# Altium schematic sheet CV060_AI.SchDoc
size A4
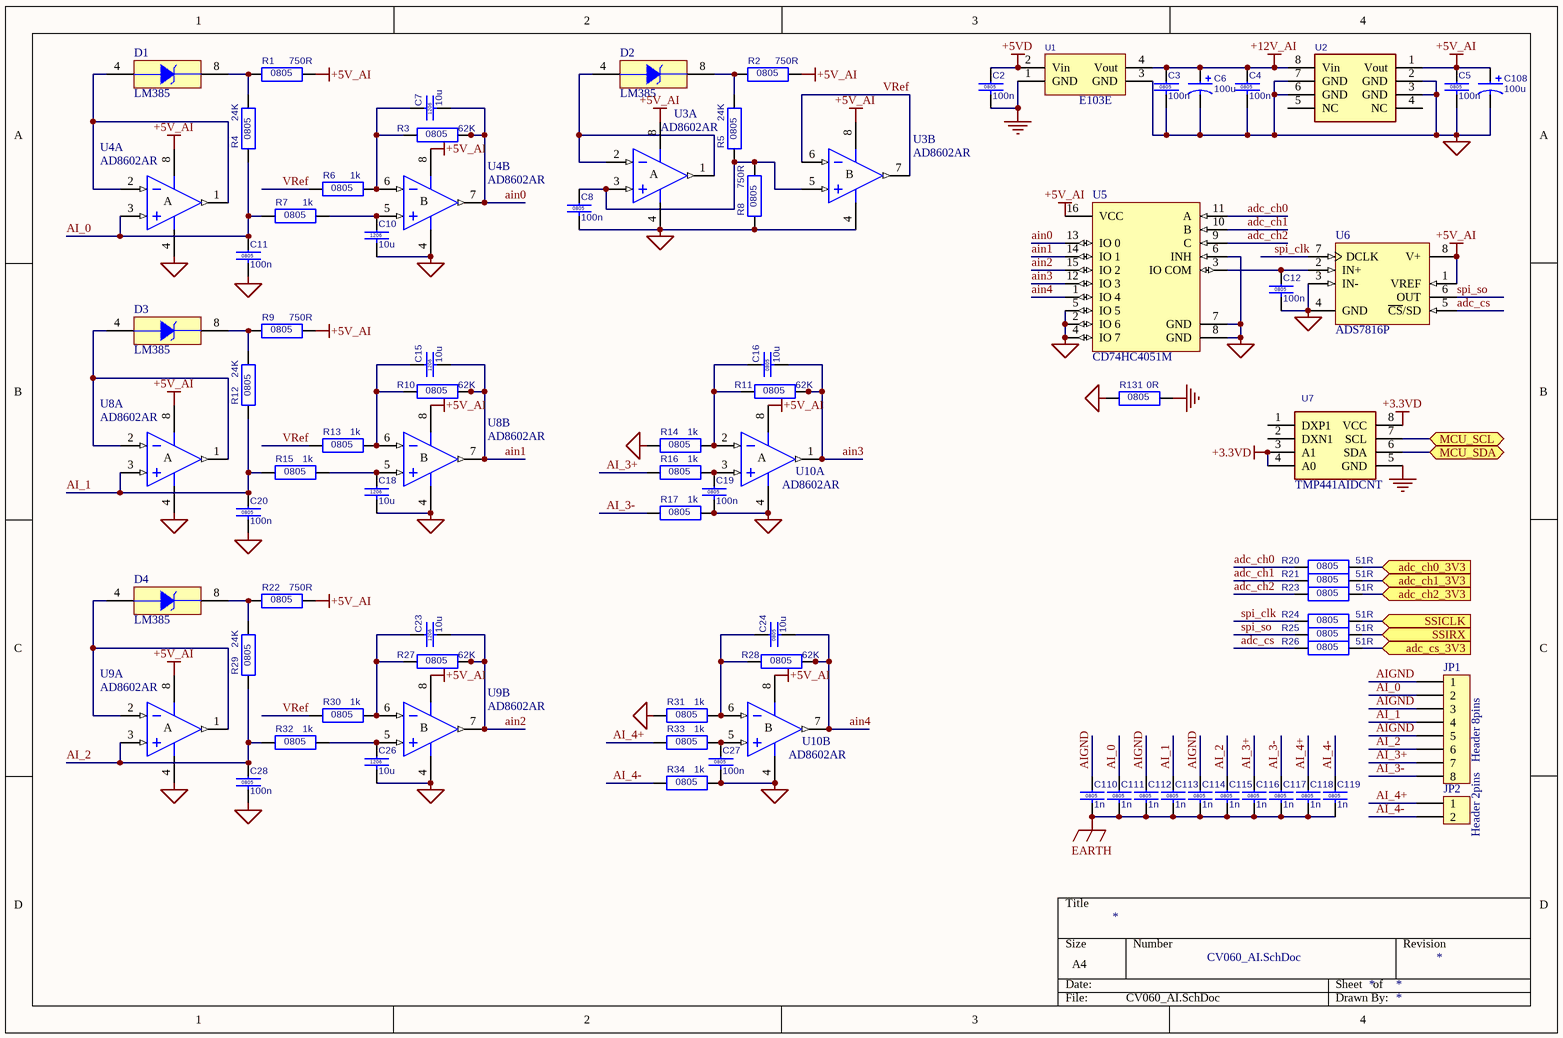
[diagram p0: CV060_AI.SchDoc]

## Parts
C2  Case: 0805  [RC0805]  (hidden comment: 100n)
C3  Case: 0805  [RC0805]  (hidden comment: 100n)
C4  Case: 0805  [RC0805]  (hidden comment: 100n)
C5  Case: 0805  [RC0805]  (hidden comment: 100n)
C6  100u  [CEH12.5D5P2.5]
C7  Case: 1206  [RC1206]  (hidden comment: 10u)
C8  Case: 0805  [RC0805]  (hidden comment: 100n)
C10  Case: 1206  [RC1206]  (hidden comment: 10u)
C11  Case: 0805  [RC0805]  (hidden comment: 100n)
C12  Case: 0805  [RC0805]  (hidden comment: 100n)
C15  Case: 1206  [RC1206]  (hidden comment: 10u)
C16  Case: 0805  [RC0805]  (hidden comment: 10u)
C18  Case: 1206  [RC1206]  (hidden comment: 10u)
C19  Case: 0805  [RC0805]  (hidden comment: 100n)
C20  Case: 0805  [RC0805]  (hidden comment: 100n)
C23  Case: 1206  [RC1206]  (hidden comment: 10u)
C24  Case: 0805  [RC0805]  (hidden comment: 10u)
C26  Case: 1206  [RC1206]  (hidden comment: 10u)
C27  Case: 0805  [RC0805]  (hidden comment: 100n)
C28  Case: 0805  [RC0805]  (hidden comment: 100n)
C108  100u  [CEH12.5D5P2.5]
C110  Case: 0805  [RC0805]  (hidden comment: 1n)
C111  Case: 0805  [RC0805]  (hidden comment: 1n)
C112  Case: 0805  [RC0805]  (hidden comment: 1n)
C113  Case: 0805  [RC0805]  (hidden comment: 1n)
C114  Case: 0805  [RC0805]  (hidden comment: 1n)
C115  Case: 0805  [RC0805]  (hidden comment: 1n)
C116  Case: 0805  [RC0805]  (hidden comment: 1n)
C117  Case: 0805  [RC0805]  (hidden comment: 1n)
C118  Case: 0805  [RC0805]  (hidden comment: 1n)
C119  Case: 0805  [RC0805]  (hidden comment: 1n)
D1  LM385  [SO-8]
D2  LM385  [SO-8]
D3  LM385  [SO-8]
D4  LM385  [SO-8]
JP1  Header 8pins  [PHOENIX_5.08_8PINS]
JP2  Header 2pins  [PHOENIX_5.08_2PINS]
R1  Case: 0805  [RC0805]  (hidden comment: 750R)
R2  Case: 0805  [RC0805]  (hidden comment: 750R)
R3  Case: 0805  [RC0805]  (hidden comment: 62K)
R4  Case: 0805  [RC0805]  (hidden comment: 24K)
R5  Case: 0805  [RC0805]  (hidden comment: 24K)
R6  Case: 0805  [RC0805]  (hidden comment: 1k)
R7  Case: 0805  [RC0805]  (hidden comment: 1k)
R8  Case: 0805  [RC0805]  (hidden comment: 750R)
R9  Case: 0805  [RC0805]  (hidden comment: 750R)
R10  Case: 0805  [RC0805]  (hidden comment: 62K)
R11  Case: 0805  [RC0805]  (hidden comment: 62K)
R12  Case: 0805  [RC0805]  (hidden comment: 24K)
R13  Case: 0805  [RC0805]  (hidden comment: 1k)
R14  Case: 0805  [RC0805]  (hidden comment: 1k)
R15  Case: 0805  [RC0805]  (hidden comment: 1k)
R16  Case: 0805  [RC0805]  (hidden comment: 1k)
R17  Case: 0805  [RC0805]  (hidden comment: 1k)
R20  Case: 0805  [RC0805]  (hidden comment: 51R)
R21  Case: 0805  [RC0805]  (hidden comment: 51R)
R22  Case: 0805  [RC0805]  (hidden comment: 750R)
R23  Case: 0805  [RC0805]  (hidden comment: 51R)
R24  Case: 0805  [RC0805]  (hidden comment: 51R)
R25  Case: 0805  [RC0805]  (hidden comment: 51R)
R26  Case: 0805  [RC0805]  (hidden comment: 51R)
R27  Case: 0805  [RC0805]  (hidden comment: 62K)
R28  Case: 0805  [RC0805]  (hidden comment: 62K)
R29  Case: 0805  [RC0805]  (hidden comment: 24K)
R30  Case: 0805  [RC0805]  (hidden comment: 1k)
R31  Case: 0805  [RC0805]  (hidden comment: 1k)
R32  Case: 0805  [RC0805]  (hidden comment: 1k)
R33  Case: 0805  [RC0805]  (hidden comment: 1k)
R34  Case: 0805  [RC0805]  (hidden comment: 1k)
R131  Case: 0805  [RC0805]  (hidden comment: 0R)
U1  Manufacturer Part Number: E103E  [SIP4]
U2  L78L05CD  [SO-8]  (value not drawn)
U3  AD8602AR  [SO-8]  (parts A,B of 2)
U4  AD8602AR  [SO-8]  (parts A,B of 2)
U5  CD74HC4051M  [SO-16]
U6  ADS7816P  [DIP-8]
U7  TMP441AIDCNT  [SOT23-8]
U8  AD8602AR  [SO-8]  (parts A,B of 2)
U9  AD8602AR  [SO-8]  (parts A,B of 2)
U10  AD8602AR  [SO-8]  (parts A,B of 2)

## Ports
adc_ch0_3V3 (in), adc_ch1_3V3 (in), adc_ch2_3V3 (in), adc_cs_3V3 (in), MCU_SCL, MCU_SDA, SSICLK (in), SSIRX (in)

## Nets
+3.3VD: U7.3(A1) U7.4(A0) U7.8(VCC)
+5V_AI: C5.1 C108.1 R1.2 R2.2 R9.2 R22.2 U2.1(Vout) U3.8(V+) U4.8(V+) U5.16(VCC) U6.1(VREF) U6.8(V+) U8.8(V+) U9.8(V+) U10.8(V+)
+5VD: C2.1 U1.2(Vin)
+12V_AI: C3.1 C4.1 C6.1 U1.4(Vout) U2.8(Vin)
AIGND: C3.2 C4.2 C5.2 C6.2 C8.2 C10.2 C11.2 C12.2 C18.2 C19.2 C20.2 C26.2 C27.2 C28.2 C108.2 C110.1 C112.1 C114.1 JP1.1 JP1.3 JP1.5 R8.1 R14.1 R17.2 R31.1 R34.2 R131.1 U1.3(GND) U2.2(GND) U2.3(GND) U2.6(GND) U2.7(GND) U3.4(V-) U4.4(V-) U5.2(IO_6) U5.4(IO_7) U5.5(IO_5) U5.6(INH) U5.7(GND) U5.8(GND) U6.3(IN-) U6.4(GND) U8.4(V-) U9.4(V-) U10.4(V-)
DGND: C2.2 R131.2 U1.1(GND) U7.5(GND)
EARTH: C110.2 C111.2 C112.2 C113.2 C114.2 C115.2 C116.2 C117.2 C118.2 C119.2
adc_ch0: R20.1 U5.11(A)
adc_ch0_3V3: R20.2 ; port adc_ch0_3V3
adc_ch1: R21.1 U5.10(B)
adc_ch1_3V3: R21.2 ; port adc_ch1_3V3
adc_ch2: R23.1 U5.9(C)
adc_ch2_3V3: R23.2 ; port adc_ch2_3V3
adc_cs: R26.1 U6.5(~{CS}/SD)
adc_cs_3V3: R26.2 ; port adc_cs_3V3
AI_0: C11.1 C111.1 JP1.2 R4.1 R7.1 U4.3(IN+)
AI_1: C20.1 C113.1 JP1.4 R12.1 R15.1 U8.3(IN+)
AI_2: C28.1 C115.1 JP1.6 R29.1 R32.1 U9.3(IN+)
AI_3+: C116.1 JP1.7 R16.1
AI_3-: C117.1 JP1.8 R17.1
AI_4+: C118.1 JP2.1 R33.1
AI_4-: C119.1 JP2.2 R34.1
ain0: C7.2 R3.2 U4.7(OUT) U5.13(IO_0)
ain1: C15.2 R10.2 U5.14(IO_1) U8.7(OUT)
ain2: C23.2 R27.2 U5.15(IO_2) U9.7(OUT)
ain3: C16.2 R11.2 U5.12(IO_3) U10.1(OUT)
ain4: C24.2 R28.2 U5.1(IO_4) U10.7(OUT)
MCU_SCL: U7.7(SCL) ; port MCU_SCL
MCU_SDA: U7.6(SDA) ; port MCU_SDA
spi_clk: R24.1 U6.7(DCLK)
spi_so: R25.1 U6.6(OUT)
SSICLK: R24.2 ; port SSICLK
SSIRX: R25.2 ; port SSIRX
VRef: R6.1 R13.1 R30.1 U3.6(IN-) U3.7(OUT)
NetC7_1: C7.1 R3.1 R6.2 U4.6(IN-)
NetC8_1: C8.1 R5.1 R8.2 U3.3(IN+) U3.5(IN+)
NetC10_1: C10.1 R7.2 U4.5(IN+)
NetC12_1: C12.1 U5.3(IO_COM) U6.2(IN+)
NetC15_1: C15.1 R10.1 R13.2 U8.6(IN-)
NetC16_1: C16.1 R11.1 R14.2 U10.2(IN-)
NetC18_1: C18.1 R15.2 U8.5(IN+)
NetC19_1: C19.1 R16.2 U10.3(IN+)
NetC23_1: C23.1 R27.1 R30.2 U9.6(IN-)
NetC24_1: C24.1 R28.1 R31.2 U10.6(IN-)
NetC26_1: C26.1 R32.2 U9.5(IN+)
NetC27_1: C27.1 R33.2 U10.5(IN+)
NetD1_4: D1.4(A) U4.1(OUT) U4.2(IN-)
NetD1_8: D1.8(K) R1.1 R4.2
NetD2_4: D2.4(A) U3.1(OUT) U3.2(IN-)
NetD2_8: D2.8(K) R2.1 R5.2
NetD3_4: D3.4(A) U8.1(OUT) U8.2(IN-)
NetD3_8: D3.8(K) R9.1 R12.2
NetD4_4: D4.4(A) U9.1(OUT) U9.2(IN-)
NetD4_8: D4.8(K) R22.1 R29.2

Not connected (* = marked no-connect by the designer): U2 4(NC) 5(NC); U7 1(DXP1) 2(DXN1)

## Notes on the sheet
- (in symbol AD8602AR, part A) A
- (in symbol AD8602AR, part B) B

## Library data of the parts
C2-C5 C8 C11 C12 C19 C20 C27 C28 = CC0805K-X5R-50V0-100N: Chip capacitor, 20p; Manufacturer: KEMET, YAGEO; Voltage: 50V; Tolerance: 10%; ROSH: Yes; Material: X5R; Package: 7" paper reel; Part number: CC0805K-X5R-50V0-100N; Suppliers: Avnet; Temperature: -55 - +125 C; Value: 100n; Supplier: Avnet-Abacus; Pb Free: Yes; Component Type: Standard; ComponentLink1Description: Manufacturer Link; ComponentLink2Description: Datasheet; ComponentLink2URL: http://www.yageo.com/pdf/UPY-GPHC_X5R_6.3V-to-50V_3.pdf; Published: 05.04.2010; Publisher: ppavlov
C6 C108 = CEH12.5D5P2.5M-16V-100U: Electrolytic capacitor; Manufacturer: Panasonic; Manufacturer Part Number: C H12.5D5P2.5M-16V-100U; Voltage: 16V; Tolerance: 20%; Pb Free: Yes; Case: 12.5x5x2.5; Value: 100u; Part Number: CEH12.5D5P2.5M-16V-100U; Temperature: -55 - +105 C; Supplier: Megasan; MOQ: 500; Component Type: Standard; ComponentLink1Description: Manufacturer Link; ComponentLink2Description: Datasheet; ComponentLink2URL: http://industrial.panasonic.com/www-data/pdf/ABA0000/ABA0000CE22.pdf; Published: 11.12.2009; Publisher: ppavlov
C7 C10 C15 C18 C23 C26 = CC1206K-X5R-10V0-10U0: Chip capacitor, 20p; Manufacturer: AVX; Manufacturer Part Number: AVX1206ZD106KAT2A; Voltage: 10V; Tolerance: 10%; ROSH: Yes; Material: X5R; Package: 7" paper reel; Part number: CC1206K-X5R-10V0-10U0; Suppliers: Avnet; Value: 10u; Stock ID: C083; Supplier: Avnet-Abacus; Pb Free: Yes; Component Type: Standard; ComponentLink1Description: Manufacturer Link; ComponentLink2Description: Datasheet; ComponentLink2URL: http://www.yageo.com/pdf/UPY-GPHC_X5R_6.3V-to-50V_3.pdf; Published: 11.11.2009; Publisher: tkondratyuk
C16 C24 = CC0805K-X7R-16V0-10U0: Chip capacitor, 20p; Manufacturer: KEMET, YAGEO; Voltage: 16V; Tolerance: 10%; ROSH: Yes; Material: X7R; Package: 7" paper reel; Part number: CC0805K-X7R-16V0-10U0; Suppliers: Avnet; Temperature: -55 - +125 C; Value: 10u; Supplier: Avnet-Abacus; Pb Free: Yes; Component Type: Standard; ComponentLink1Description: Manufacturer Link; ComponentLink2Description: Datasheet; ComponentLink2URL: http://www.yageo.com/pdf/UPY-GPHC_X7R_6.3V-to-50V_3.pdf; Published: 11.11.2009; Publisher: tkondratyuk
C110-C119 = CC0805K-X5R-50V0-1N00: Chip capacitor, 20p; Manufacturer: KEMET, YAGEO; Voltage: 50V; Tolerance: 10%; ROSH: Yes; Material: X5R; Package: 7" paper reel; Part number: CC0805K-X5R-50V0-1N00; Suppliers: Avnet; Temperature: -55 - +125 C; Value: 1n; Supplier: Avnet-Abacus; Pb Free: Yes; Component Type: Standard; ComponentLink1Description: Manufacturer Link; ComponentLink2Description: Datasheet; ComponentLink2URL: http://www.yageo.com/pdf/UPY-GPHC_X5R_6.3V-to-50V_3.pdf; Published: 05.04.2010; Publisher: ppavlov
D1-D4 = LM385BD-2-5: Micropower Voltage Reference Diode; Manufacturer: TI; Pb Free: Yes; Part Number: LM385BD-2-5; Temperature: -40 - +125 C; Manufacturer Part Number: LM385BD-2-5; Component Type: Standard; ComponentLink1Description: Manufacturer Link; Case: SO-8; ComponentLink2Description: Datasheet; Published: 05.01.2010; Publisher: ppavlov
JP1 = 2EDGR-5.08-08P-14: 5.08mm angled 8pins receptabe; Manufacturer Part Number: 2EDGR-5.0-08P-14; Pins number: 8; Pb Free: Yes; Part Number: 2EDGR-5.08-08P-14; Temperature: -40 - +105 C; Supplier: Biakom; Component Type: Standard; ComponentLink1Description: Manufacturer Link; Case: PHOENIX_5.08_8PINS; ComponentLink2Description: Datasheet; Published: 17.08.2010; Publisher: ppavlov
JP2 = 2EDGR-5.08-02P-14: 5mm angled 2pins receptabe; Manufacturer Part Number: 2EDGR-5.0-02P-14; Pins number: 2; Pb Free: Yes; Part Number: 2EDGR-5.08-02P-14; Temperature: -40 - +105 C; Component Type: Standard; ComponentLink1Description: Manufacturer Link; Case: PHOENIX_5.08_2PINS; ComponentLink2Description: Datasheet; Published: 04.01.2010; Publisher: ppavlov
R1 R2 R8 R9 R22 = RC0805F-750R: Chip resistor; Manufacturer: PHILIPS, SAMSUNG; Voltage: 200V; Power: 1/10W; Tolerance: 1%; Pb Free: Yes; Value: 750R; Part Number: RC0805F-750R; Temperature: -55 - +155 C; Supplier: Megasan; Component Type: Standard; ComponentLink1Description: Manufacturer Link; ComponentLink2Description: Datasheet; ComponentLink2URL: http://www.yageo.com/pdf/PYu-RC1206_51_RoHS_L_4.pdf; Published: 11.12.2009; Publisher: ppavlov
R3 R10 R11 R27 R28 = RC0805F-62K0: Chip resistor; Manufacturer: PHILIPS, SAMSUNG; Voltage: 200V; Power: 1/10W; Tolerance: 1%; Pb Free: Yes; Value: 62K; Part Number: RC0805F-62K0; Temperature: -55 - +155 C; Supplier: Megasan; Component Type: Standard; ComponentLink1Description: Manufacturer Link; ComponentLink2Description: Datasheet; ComponentLink2URL: http://www.yageo.com/pdf/PYu-RC1206_51_RoHS_L_4.pdf; Published: 11.12.2009; Publisher: ppavlov
R4 R5 R12 R29 = RC0805F-24K0: Chip resistor; Manufacturer: PHILIPS, SAMSUNG; Voltage: 200V; Power: 1/10W; Tolerance: 1%; Pb Free: Yes; Value: 24K; Part Number: RC0805F-24K0; Temperature: -55 - +155 C; Supplier: Megasan; Component Type: Standard; ComponentLink1Description: Manufacturer Link; ComponentLink2Description: Datasheet; ComponentLink2URL: http://www.yageo.com/pdf/PYu-RC1206_51_RoHS_L_4.pdf; Published: 11.12.2009; Publisher: ppavlov
R6 R7 R13-R17 R30-R34 = RC0805F-1K00: Chip resistor; Manufacturer: PHILIPS, SAMSUNG; Voltage: 200V; Power: 1/10W; Tolerance: 1%; Pb Free: Yes; Value: 1k; Part Number: RC0805F-1K00; Temperature: -55 - +155 C; Supplier: Megasan; Component Type: Standard; ComponentLink1Description: Manufacturer Link; ComponentLink2Description: Datasheet; ComponentLink2URL: http://www.yageo.com/pdf/PYu-RC1206_51_RoHS_L_4.pdf; Published: 11.12.2009; Publisher: ppavlov
R20 R21 R23-R26 = RC0805F-51R0: Chip resistor; Manufacturer: PHILIPS, SAMSUNG; Voltage: 200V; Power: 1/10W; Tolerance: 1%; Pb Free: Yes; Value: 51R; Part Number: RC0805F-51R0; Temperature: -55 - +155 C; Supplier: Megasan; Component Type: Standard; ComponentLink1Description: Manufacturer Link; ComponentLink2Description: Datasheet; ComponentLink2URL: http://www.yageo.com/pdf/PYu-RC1206_51_RoHS_L_4.pdf; Published: 11.12.2009; Publisher: ppavlov
R131 = RC0805F-000R: Chip resistor; Manufacturer: PHILIPS, SAMSUNG; Voltage: 200V; Power: 1/10W; Tolerance: 1%; Pb Free: Yes; Value: 0R; Part Number: RC0805F-000R; Temperature: -55 - +155 C; Supplier: Megasan; Component Type: Standard; ComponentLink1Description: Manufacturer Link; ComponentLink2Description: Datasheet; ComponentLink2URL: http://www.yageo.com/pdf/PYu-RC1206_51_RoHS_L_4.pdf; Published: 11.12.2009; Publisher: ppavlov
U1 = 1-05-12S: 1W Insulated DCDC converter 5 to 12V; Manufacturer: TI; Pb Free: Yes; Part Number: 1-05-12S; Temperature: -40 - +85 C; Component Type: Standard; ComponentLink1Description: Manufacturer Link; Case: SIP4; ComponentLink2Description: Datasheet; Published: 07.01.2010; Publisher: ppavlov
U2 = L78L05CD: Regulator 100ma 5V; Manufacturer: ST; Pb Free: Yes; Part Number: L78L05CD; Temperature: -40 - +150 C; Manufacturer Part Number: L78L05CD; Component Type: Standard; ComponentLink1Description: Manufacturer Link; Case: SO-8; ComponentLink2Description: Datasheet; Published: 07.01.2010; Publisher: ppavlov
U3 U4 U8-U10 = AD8602AR: Dual Precision, Low-Power BiFET Operational Amplifier; Manufacturer: AD; Pb Free: Yes; ID: AD8602AR; Type: IC; Value: AD8602AR; Part Number: AD8602AR; Temperature: -40 - +125 C; Manufacturer Part Number: AD8602AR; Component Type: Standard; ComponentLink1Description: Manufacturer Link; Case: SO-8; ComponentLink2Description: Datasheet; ComponentLink2URL: http://www.analog.com/static/imported-files/Data_Sheets/AD8601_8602_8604.pdf; Published: 05.01.2010; Publisher: ppavlov
U5 = CD74HC4051M: High-Speed CMOS Logic / Analog Multiplexers/Demultiplexers; Manufacturer: TI; Package Information: Latest Revision: Jan-1997; Pb Free: Yes; Published: 06.01.2010; Revision: 17-Jul-2002: Re-released for DXP Platform.; Datasheet: Latest Revision: Jun-1989; Package Reference: SO16; Publisher: ppavlov; Part Number: CD74HC4051M; Temperature: -55 - +125 C; Supplier: EBV; Manufacturer Part Number: CD74HC4051M; Component Type: Standard; ComponentLink1Description: Manufacturer Link; Case: SO-16; ComponentLink2Description: Datasheet; ComponentLink2URL: http://focus.ti.com/docs/prod/folders/print/cd74hct4051.html
U6 = ADS7816P: 12bit ADC; Manufacturer: TI; Pb Free: Yes; Part Number: ADS7816P; Temperature: -40 - +100 C; Manufacturer Part Number: ADS7816P; Component Type: Standard; ComponentLink1Description: Manufacturer Link; Case: DIP-8; ComponentLink2Description: Datasheet; Published: 05.01.2010; Publisher: ppavlov
U7 = TMP441AIDCNT: ± 1 ° C TEMPERATURE SENSOR / with Automatic Beta Compensation; Manufacturer: TI; Pb Free: Yes; Part Number: TMP441AIDCNT; Temperature: – 55 - +127 C; Manufacturer Part Number: TMP441AIDCNT; Component Type: Standard; ComponentLink1Description: Manufacturer Link; Case: SOT23-8; ComponentLink2Description: Datasheet; Published: 17.11.2009; Publisher: ppavlov